# Altium schematic sheet Hat.SchDoc: Group 32 Hat
size A3; DrawnBy: *Names to Left*; Address1: ECE Department; Address2: University of Canterbury; Address3: Christchurch 8041; Address4: New Zealand; Revision: 1; ImagePath: C:\Users\fletc\Documents\Uni Notes\Third Pro\ENCE461\PCB\wacky-racers-pcb\Templates\uc-logo.png
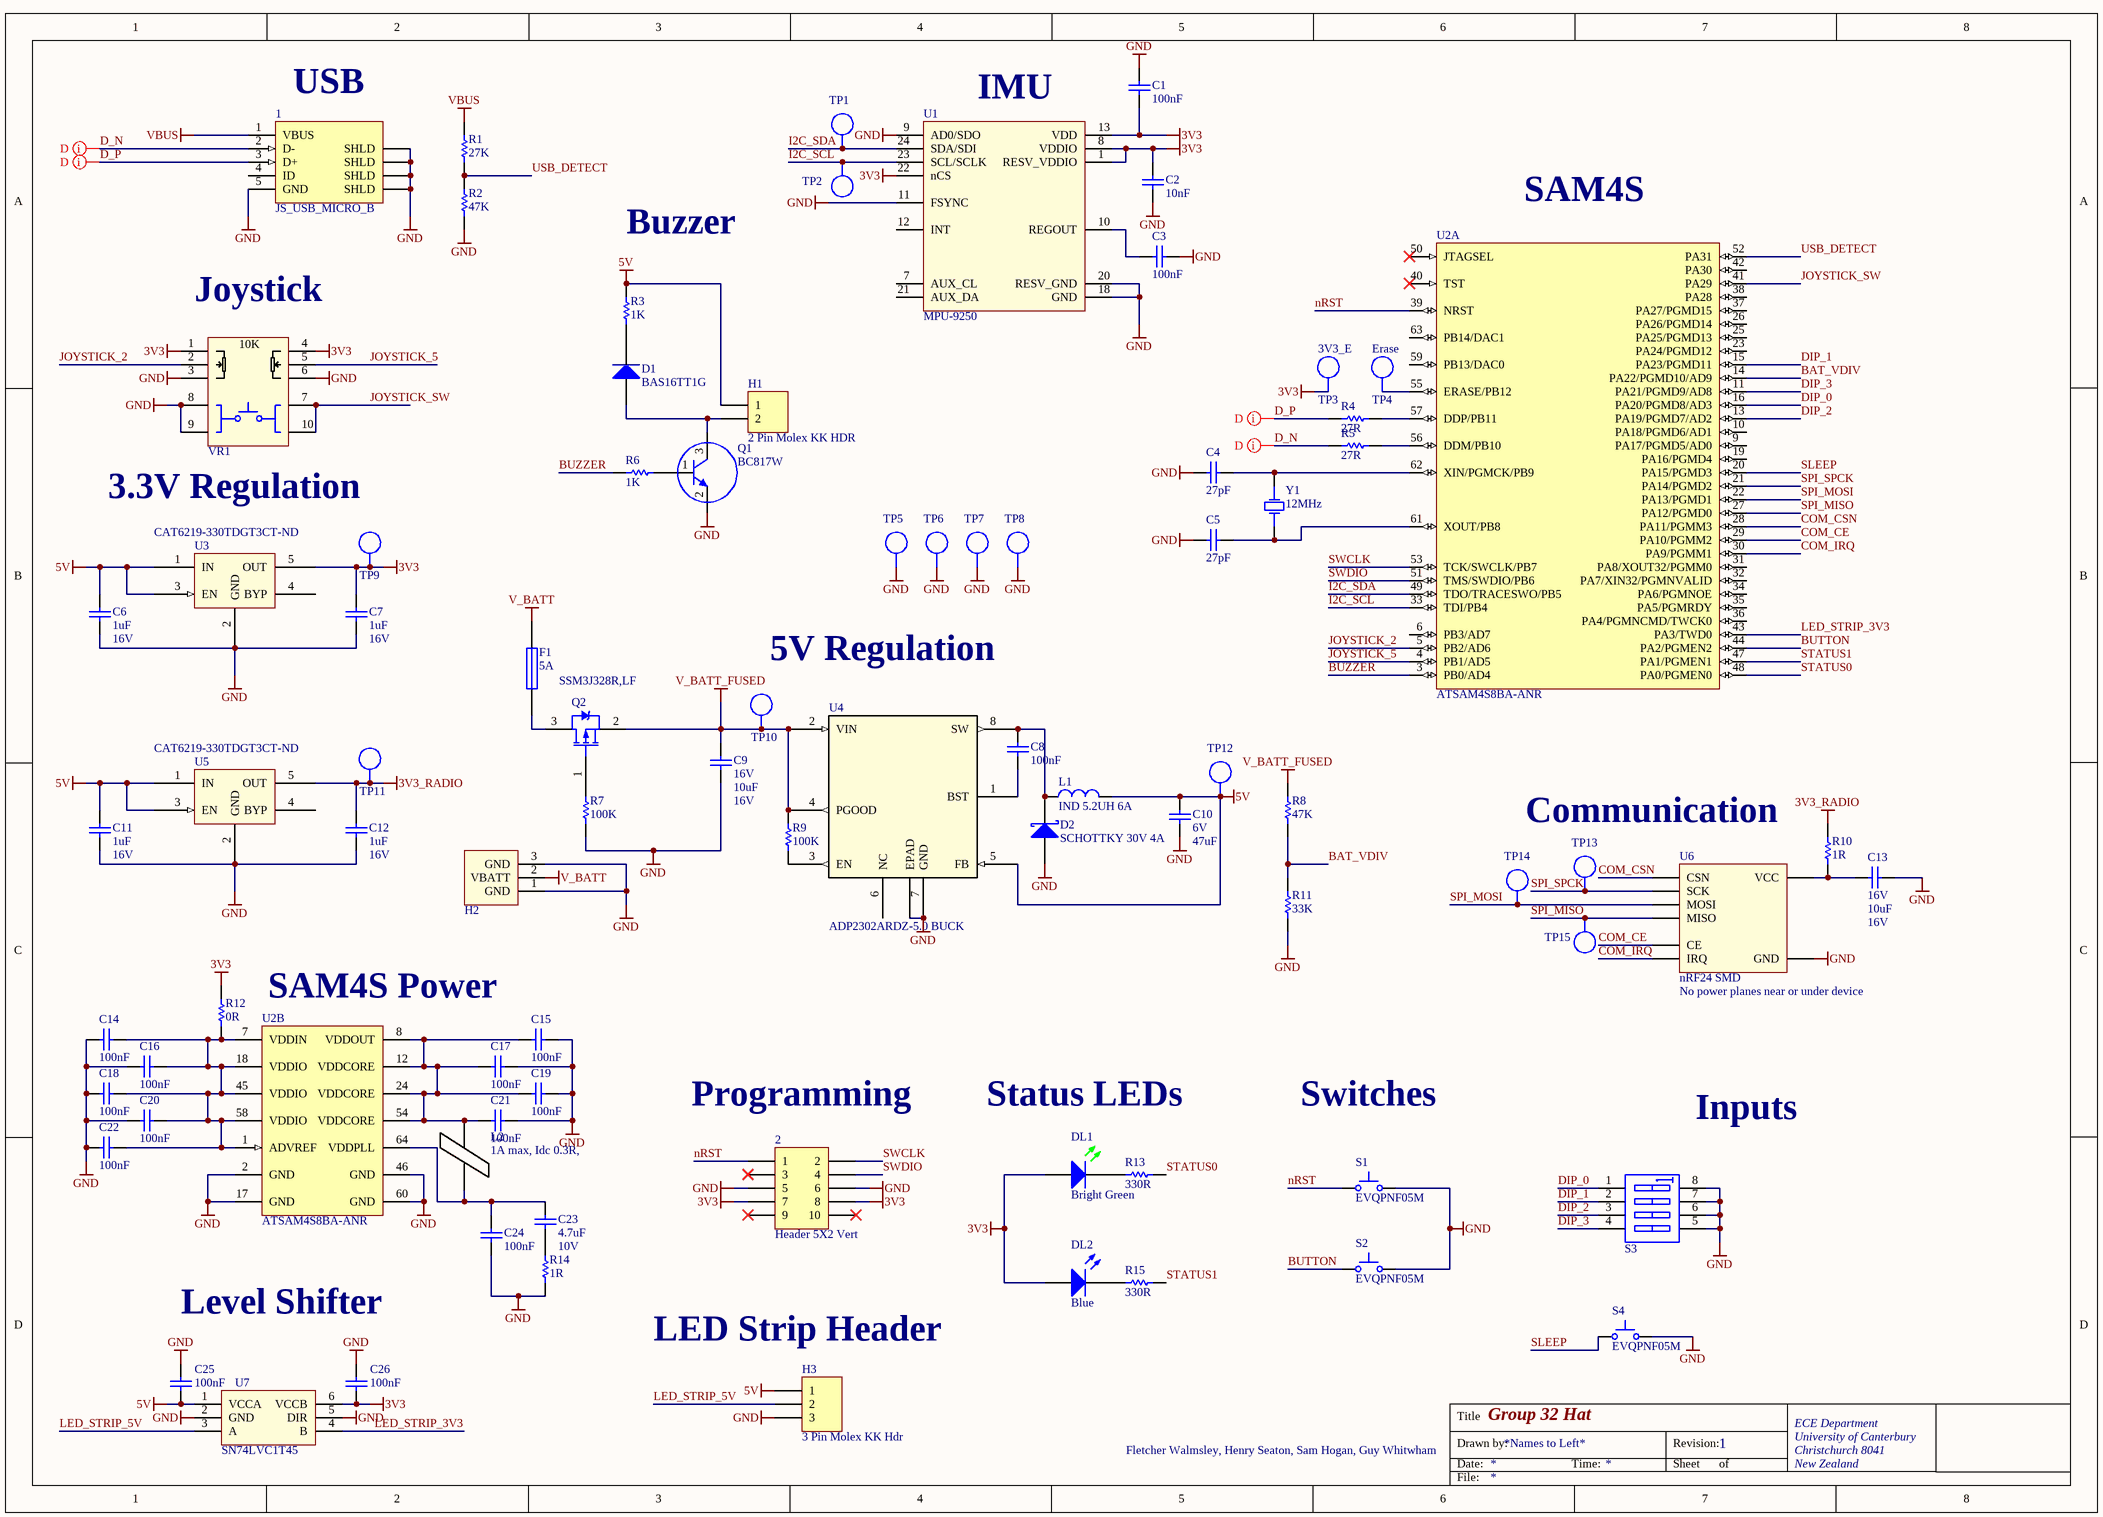
[diagram p0: Hat.SchDoc]

## Parts
1  JS_USB_MICRO_B  [FCI_USB_10118194-0001LF]
2  Header 5X2 Vert  [IDC2.54-V10D]
C1  100nF  [CAPC1608L]
C2  10nF  [CAPC1608L]
C3  100nF  [CAPC1608L]
C4  27pF  [CAPC1608L]
C5  27pF  [CAPC1608L]
C6  Max Voltage: 16V  [CAPC1608L]  (hidden comment: 1uF)
C7  Max Voltage: 16V  [CAPC1608L]  (hidden comment: 1uF)
C8  100nF  [CAPC1608L]
C9  Voltage - Rated: 16V  [CAPC2012L]  (hidden comment: 10uF)
C10  Max Voltage: 6V  [CAPC3216L]  (hidden comment: 47uF)
C11  Max Voltage: 16V  [CAPC1608L]  (hidden comment: 1uF)
C12  Max Voltage: 16V  [CAPC1608L]  (hidden comment: 1uF)
C13  Voltage - Rated: 16V  [CAPC2012L]  (hidden comment: 10uF)
C14  100nF  [CAPC1608L]
C15  100nF  [CAPC1608L]
C16  100nF  [CAPC1608L]
C17  100nF  [CAPC1608L]
C18  100nF  [CAPC1608L]
C19  100nF  [CAPC1608L]
C20  100nF  [CAPC1608L]
C21  100nF  [CAPC1608L]
C22  100nF  [CAPC1608L]
C23  Max Voltage: 10V  [CAPC1608N]  (hidden comment: 4.7uF)
C24  100nF  [CAPC1608L]
C25  100nF  [CAPC1608L]
C26  100nF  [CAPC1608L]
D1  BAS16TT1G  [SOT416]
D2  SCHOTTKY 30V 4A  [SMC]
DL1  Bright Green  [WL-SMCW0603]
DL2  Blue  [WL-SMCW0603]
F1  5A  [RESC3216N]
H1  2 Pin Molex KK HDR  [MOLEX_KK_2_HDR]
H2  Battery_HEADER_3pin  [BATT_HEADER_3POS]  (value not drawn)
H3  3 Pin Molex KK Hdr  [MOLEX_KK_3_HDR]
L1  IND 5.2UH 6A  [INDUCTOR5u2]
L2  1A max, Idc 0.3R,  [INDC3216L]
Q1  BC817W  [SOT323_M]
Q2  SSM3J328R,LF  [SOT23_L]
R1  27K  [RESC1608L]
R2  47K  [RESC1608N]
R3  1K  [RESC1608L]
R4  27R  [RESC1608L]
R5  27R  [RESC1608L]
R6  1K  [RESC1608L]
R7  100K  [RESC1608L]
R8  47K  [RESC1608N]
R9  100K  [RESC1608L]
R10  1R  [RESC3216L]
R11  33K  [RESC1608L]
R12  0R  [RESC1608L]
R13  330R  [RESC1608L]
R14  1R  [RESC3216L]
R15  330R  [RESC1608L]
S1  EVQPNF05M  [EVQPNF05M]
S2  EVQPNF05M  [EVQPNF05M]
S3  WS_SW DIP-4  [DIP_SW_4WAY_SMD -]  (value not drawn)
S4  EVQPNF05M  [EVQPNF05M]
TP1  SDA  [TP_1206]  (value not drawn)  (no BOM)
TP2  SCK  [TP_1206]  (value not drawn)  (no BOM)
TP3  3V3_E  [TP_1206]  (no BOM)
TP4  Erase  [TP_1206]  (no BOM)
TP5  GND  [TP_1206]  (value not drawn)  (no BOM)
TP6  GND  [TP_1206]  (value not drawn)  (no BOM)
TP7  GND  [TP_1206]  (value not drawn)  (no BOM)
TP8  GND  [TP_1206]  (value not drawn)  (no BOM)
TP9  3V3  [TP_1206]  (value not drawn)  (no BOM)
TP10  V_BATT  [TP_1206]  (value not drawn)  (no BOM)
TP11  3V3_R  [TP_1206]  (value not drawn)  (no BOM)
TP12  5V  [TP_1206]  (value not drawn)  (no BOM)
TP13  SPCK  [TP_1206]  (value not drawn)  (no BOM)
TP14  MOSI  [TP_1206]  (value not drawn)  (no BOM)
TP15  MISO  [TP_1206]  (value not drawn)  (no BOM)
U1  MPU-9250  [Quad24]
U2  ATSAM4S8BA-ANR  [LQFP64_L]  (parts A,B of 2)
U3  Supplier Part Number: CAT6219-330TDGT3CT-ND  [SOT95P280X145-5N]  (hidden comment: CAT6219-330TDGT3)
U4  ADP2302ARDZ-5.0 BUCK  [RD_8_1]
U5  Supplier Part Number: CAT6219-330TDGT3CT-ND  [SOT95P280X145-5N]  (hidden comment: CAT6219-330TDGT3)
U6  nRF24 SMD  Warning: No power planes near or under device  [NRF24]
U7  SN74LVC1T45  [SOT23-6_N]
VR1  Joystick 10k with Sw  [Joystick_Sw]  (value not drawn)
Y1  12MHz  [6.0X3.5-4]

## Nets
3V3: 2.7 2.8 C1.1 C2.2 C7.2 C26.1 DL1.2(A) DL2.2(A) R12.2 TP3.1 TP9.1 U1.1(RESV_VDDIO) U1.8(VDDIO) U1.13(VDD) U1.22(nCS) U3.5(OUT) U7.6(VCCB) VR1.1 VR1.4(1')
3V3_RADIO: C12.2 R10.2 TP11.1 U5.5(OUT)
5V: C6.2 C10.2 C11.2 C25.1 H1.1 H3.1 L1.2 R3.1 TP12.1 U3.1(IN) U3.3(EN) U4.5(FB) U5.1(IN) U5.3(EN) U7.1(VCCA)
GND: 1.5(GND) 1.6(SHLD) 2.5 2.6 C1.2 C2.1 C3.2 C4.1 C5.1 C6.1 C7.1 C9.1 C10.1 C11.1 C12.1 C13.1 C14.1 C15.2 C16.1 C17.2 C18.1 C19.2 C20.1 C21.2 C22.1 C24.1 C25.2 C26.2 D2.1(A) H2.1(GND) H2.3(GND) H3.3 Q1.2 R2.1 R7.1 R11.2 R14.2 S1.2 S2.2 S3.5(B4) S3.6(B3) S3.7(B2) S3.8(B1) S4.2 TP5.1 TP6.1 TP7.1 TP8.1 U1.9(AD0/SDO) U1.11(FSYNC) U1.18(GND) U1.20(RESV_GND) U2.2(GND) U2.17(GND) U2.46(GND) U2.60(GND) U3.2(GND) U4.7(GND) U4.EPAD U5.2(GND) U6.2(GND) U7.2(GND) U7.5(DIR) VR1.3 VR1.6(3') VR1.8 VR1.9
V_BATT: F1.2 H2.2(VBATT)
V_BATT_FUSED: C9.2 Q2.2 R8.1 R9.2 TP10.1 U4.2(VIN) U4.4(PGOOD)
VBUS: 1.1(VBUS) R1.2
BAT_VDIV: R8.2 R11.1 U2.14(PA22/PGMD10/AD9)
BUTTON: S2.1 U2.44(PA2/PGMEN2)
BUZZER: R6.2 U2.3(PB0/AD4)
COM_CE: U2.29(PA10/PGMM2) U6.3(CE)
COM_CSN: U2.28(PA11/PGMM3) U6.4(CSN)
COM_IRQ: U2.30(PA9/PGMM1) U6.8(IRQ)
D_N: 1.2(D-) R5.1
D_P: 1.3(D+) R4.1
DIP_0: S3.1(A1) U2.16(PA20/PGMD8/AD3)
DIP_1: S3.2(A2) U2.15(PA23/PGMD11)
DIP_2: S3.3(A3) U2.13(PA19/PGMD7/AD2)
DIP_3: S3.4(A4) U2.11(PA21/PGMD9/AD8)
I2C_SCL: TP2.1 U1.23(SCL/SCLK) U2.33(TDI/PB4)
I2C_SDA: TP1.1 U1.24(SDA/SDI) U2.49(TDO/TRACESWO/PB5)
JOYSTICK_2: U2.5(PB2/AD6) VR1.2
JOYSTICK_5: U2.4(PB1/AD5) VR1.5(2')
JOYSTICK_SW: U2.41(PA29) VR1.7 VR1.10
LED_STRIP_3V3: U2.43(PA3/TWD0) U7.4(B)
LED_STRIP_5V: H3.2 U7.3(A)
nRST: 2.1 S1.1 U2.39(NRST)
SLEEP: S4.1 U2.20(PA15/PGMD3)
SPI_MISO: TP15.1 U2.27(PA12/PGMD0) U6.7(MISO)
SPI_MOSI: TP14.1 U2.22(PA13/PGMD1) U6.6(MOSI)
SPI_SPCK: TP13.1 U2.21(PA14/PGMD2) U6.5(SCK)
STATUS0: R13.2 U2.48(PA0/PGMEN0)
STATUS1: R15.2 U2.47(PA1/PGMEN1)
SWCLK: 2.2 U2.53(TCK/SWCLK/PB7)
SWDIO: 2.4 U2.51(TMS/SWDIO/PB6)
USB_DETECT: R1.1 R2.2 U2.52(PA31)
NetC3_1: C3.1 U1.10(REGOUT)
NetC4_2: C4.2 U2.62(XIN/PGMCK/PB9) Y1.3(OSC2)
NetC5_2: C5.2 U2.61(XOUT/PB8) Y1.1(OSC1)
NetC8_1: C8.1 U4.1(BST)
NetC8_2: C8.2 D2.2(K) L1.1 U4.8(SW)
NetC13_2: C13.2 R10.1 U6.1(VCC)
NetC14_2: C14.2 C16.2 C18.2 C20.2 C22.2 R12.1 U2.1(ADVREF) U2.7(VDDIN) U2.18(VDDIO) U2.45(VDDIO) U2.58(VDDIO)
NetC15_1: C15.1 C17.1 C19.1 C21.1 L2.2 U2.8(VDDOUT) U2.12(VDDCORE) U2.24(VDDCORE) U2.54(VDDCORE)
NetC23_1: C23.1 C24.2 L2.1 U2.64(VDDPLL)
NetC23_2: C23.2 R14.1
NetD1_1: D1.1(A) H1.2 Q1.3
NetD1_3: D1.3(K) R3.2
NetDL1_1: DL1.1(K) R13.1
NetDL2_1: DL2.1(K) R15.1
NetF1_1: F1.1 Q2.3
NetQ1_1: Q1.1 R6.1
NetQ2_1: Q2.1 R7.2
NetR4_2: R4.2 U2.57(DDP/PB11)
NetR5_2: R5.2 U2.56(DDM/PB10)
NetR9_1: R9.1 U4.3(EN)
NetTP4_1: TP4.1 U2.55(ERASE/PB12)

Not connected (* = marked no-connect by the designer): 1 4(ID); 2 3* 9* 10*; U1 7(AUX_CL) 12(INT) 21(AUX_DA); U2 6(PB3/AD7) 9(PA17/PGMD5/AD0) 10(PA18/PGMD6/AD1) 19(PA16/PGMD4) 23(PA24/PGMD12) 25(PA25/PGMD13) 26(PA26/PGMD14) 31(PA8/XOUT32/PGMM0) 32(PA7/XIN32/PGMNVALID) 34(PA6/PGMNOE) 35(PA5/PGMRDY) 36(PA4/PGMNCMD/TWCK0) 37(PA27/PGMD15) 38(PA28) 40(TST)* 42(PA30) 50(JTAGSEL)* 59(PB13/DAC0) 63(PB14/DAC1); U3 4(BYP); U4 6(NC); U5 4(BYP)

## Layout directives
differential pair: D_N, D_P

## Notes on the sheet
- (near 1) USB
- (near U1) IMU
- (near U2) SAM4S
- Buzzer
- (near VR1) Joystick
- 3.3V Regulation
- 5V Regulation
- Communication
- (near U2) SAM4S Power
- (near 2) Programming
- Status LEDs
- Switches
- Inputs
- Level Shifter
- (near H3) LED Strip Header
- Fletcher Walmsley, Henry Seaton, Sam Hogan, Guy Whitwham
- Title
- Drawn by:
- Date:
- Time:
- Revision:
- Sheet
- of
- File:
- (in symbol Joystick 10k with Sw) 10K

## Library data of the parts
1 = JS_USB_MICRO_B_SMT: CONN USB MICRO B RECPT SMT R/A; Manufacturer: FCI; Manufacturer Part Number: 10118194-0001LF; Gender: Receptacle; Number of Contacts: 5; Specifications: USB 2.0; Supplier 1: Digi-Key; Supplier Part Number 1: 609-4618-1-ND; Features: Shielded, Solder Retention; Mounting Type: Surface Mount, Right Angle, Horizontal
2 = JA_HDR_IDC_5X2_VERT: IDC Header, 2,54mm, 10-Pin, Vert; Supplier: ECE Dept; Supplier 1: Farnell; Supplier Part Number 1: 1096985; Storage Location: ECE Dept Store
C1 C3 C8 C14-C22 C24-C26 = CC_100nF_0603: CAP CER 100nF X7R +-10% 50V 0603; PackageReference: 0603; Code_IPC: 1608 [0603]; Verify: *; Supplier: ECE Dept; Storage Location: PCB Assembly WS; Value: 100nF
C2 = CC_10nF_0603: CAP CER 10nF X7R +-10% 50V 0603; PackageReference: 0603; Code_IPC: 1608 [0603]; Verify: *; Supplier: ECE Dept; Storage Location: PCB Assembly WS; Value: 10nF
C4 C5 = CC_27pF_0603: CAP CER 27pF NPO/COG +-5% 50V 0603; PackageReference: 0603; Code_IPC: 1608 [0603]; Verify: *; Supplier: ECE Dept; Storage Location: PCB Assembly WS; Value: 27pF
C6 C7 C11 C12 = CC_1uF_0603: CAP CER 1uF Y5V -20% +80% 16V 0603; PackageReference: 0603; Code_IPC: 1608 [0603]; Verify: *; Supplier: ECE Dept; Storage Location: PCB Assembly WS; Value: 1uF
C9 C13 = CC_10uF_16V_0805: CAP CER 10uF X5R 16V 0805; Manufacturer: Samsung Electro-Mechanics; Manufacturer Part Number: CL21A106KOQNNWE; Note: Footprint corresponds to dimensions for bulk cassette packaging. This case size has tightened tolerances.; Tolerance: ±10%; Notification: Current market demand for these product types have resulted in fluctuating and extending lead times. Lead times may differ.; PackageReference: 0805; Code_IPC: 2012[0805]; Supplier 1: Digi-Key; RoHS: RoHS Compliant; Category: Capacitors; Stock 1: 20000; Pricing 1: 1=0.35, 10=0.25, 100=0.1178, 500=0.08254, 1000=0.06831 (NZD); Packaging: Cut Tape (CT); Part Status: Active; Temperature Coefficient: X5R; Operating Temperature: -55°C ~ 85°C; Features: -; Ratings: -; Applications: General Purpose; Mounting Type: Surface Mount, MLCC; Package / Case: 0805 (2012 Metric); Size / Dimension: 0.079" L x 0.049" W (2.00mm x 1.25mm); Height - Seated (Max): -; Thickness (Max): 0.055" (1.40mm); Lead Spacing: -; Lead Style: -; ComponentLink1URL: http://www.samsungsem.com/kr/support/product-search/mlcc/CL21A106KOQNNWE.jsp; ComponentLink1Description: http://www.samsungsem.com/kr/support/product-search/mlcc/CL21A106KOQNNWE.jsp; Supplier Part Number 1: 1276-2894-1-ND; Value: 10uF; Max Voltage: 16V
C10 = CC_47uF_1206: CAP CER 47uF X5R -/+20% 6V 1206; Verify: *; Supplier: ECE Dept; Storage Location: PCB Assembly WS; Dielectric: X5R; Footprint: 1210 (3225 metric); MoV: 6V; Value: 47uF
C23 = CC_4.7uF_0603: CAP CER 4.7uF X5R +-20%  10V 0603; Note: Footprint corresponds to dimensions for bulk cassette packaging. This case size has tightened tolerances.; PackageReference: 0805; Code_IPC: 2012[0805]; Verify: *; Supplier: ECE Dept; Storage Location: PCB Assembly WS; Value: 4.7uF
D1 = DR_BAS16TT1G: Diode Switching, Vr 75V, 200mA, SOT-416; Manufacturer: ON Semiconductor; Max Surge Current: 500mA; Forward Voltage: 1.25V; Peak Reverse Current: 1uA; Recovery Time: 6ns; Power Dissipation: 225mW; Element Configuration: Single; Polarity: Standard; Max Reverse Voltage (DC): 100V; Manufacturer PN: BAS16TT1G; Storage Location: PCB Assembly WS; Supplier: ECE Dept; Manufacturer Part Number: BAS16TT1G; Case/Package: SOT-416-3; Number of Pins: 3; Contact Plating: Tin,Matte; Min Operating Temperature: -55°C; Max Operating Temperature: 150°C; Package Quantity: 1; Packaging: Tape and Reel; Forward Current: 200mA; Average Rectified Current: 200mA; Reverse Recovery Time: 6ns; Peak Non-Repetitive Surge Current: 500mA; Max Repetitive Reverse Voltage (Vrrm): 75V; Max Forward Surge Current (Ifsm): 500mA; Current Rating: 200mA; Output Current: 200mA; Length: 1.65mm; Height: 0.9mm; Width: 0.9mm; Radiation Hardening: No; REACH SVHC: No SVHC; Lead Free: Lead Free; Halogen Free: Halogen Free; ComponentLink1URL: https://datasheet.ciiva.com/8299/bas16tt1-d-8299729.pdf; ComponentLink1Description: https://datasheet.ciiva.com/8299/bas16tt1-d-8299729.pdf; ComponentLink2URL: https://datasheet.ciiva.com/4435/bas16tt1-d-103455-4435027.pdf; ComponentLink2Description: https://datasheet.ciiva.com/4435/bas16tt1-d-103455-4435027.pdf; ComponentLink3URL: https://datasheet.ciiva.com/28646/bas16tt1-d-28646580.pdf; ComponentLink3Description: https://datasheet.ciiva.com/28646/bas16tt1-d-28646580.pdf; ComponentLink4URL: https://datasheet.ciiva.com/16393/bas16tt1-d-16393622.pdf; ComponentLink4Description: https://datasheet.ciiva.com/16393/bas16tt1-d-16393622.pdf; ComponentLink5URL: https://datasheet.ciiva.com/923/bas16tt1-d-923016.pdf; ComponentLink5Description: https://datasheet.ciiva.com/923/bas16tt1-d-923016.pdf; ComponentLink6URL: https://datasheet.ciiva.com/923/bas16tt1-d-923017.pdf; ComponentLink6Description: https://datasheet.ciiva.com/923/bas16tt1-d-923017.pdf; ComponentLink7URL: https://datasheet.ciiva.com/923/bas16tt1-d-923018.pdf; ComponentLink7Description: https://datasheet.ciiva.com/923/bas16tt1-d-923018.pdf; ComponentLink8URL: https://datasheet.ciiva.com/25930/bas16tt1-d-25930986.pdf; ComponentLink8Description: https://datasheet.ciiva.com/25930/bas16tt1-d-25930986.pdf; Supplier 1: Digi-Key; Supplier 2: Farnell; Supplier Part Number 2: 2844752; Supplier Part Number 1: BAS16TT1GOSDKR-ND; Value: BAS16TT1G
D2 = MBRS330T3G: DIODE SCHOTTKY 30V 4A SMC; Manufacturer: ON Semiconductor; Speed: Fast Recovery =< 500ns, > 200mA (Io); Supplier 1: Digi-Key; Manufacturer Part Number: MBRS330T3G; RoHS: RoHS Compliant; Category: Discrete Semiconductor Products; Stock 1: 8919; Pricing 1: 1=0.93, 10=0.79, 100=0.5902, 500=0.46368, 1000=0.35829 (NZD); Packaging: Cut Tape (CT); Part Status: Active; Diode Type: Schottky; Current - Average Rectified (Io): 4A; Capacitance @ Vr, F: -; Mounting Type: Surface Mount; Package / Case: DO-214AB, SMC; Supplier Device Package: SMC; Operating Temperature - Junction: -65°C ~ 150°C; Base Part Number: MBRS330; ComponentLink1URL: http://www.onsemi.com/pub/Collateral/MBRS340T3-D.PDF; ComponentLink1Description: http://www.onsemi.com/pub/Collateral/MBRS340T3-D.PDF; Supplier Part Number 1: MBRS330T3GOSCT-ND
DL1 = DL_150060VS75000: LED Bright Green 40mcd 0603 SMD; Manufacturer: WURTH ELEKTRONIK; Forward Current If: 30; Forward Voltage: 2; Viewing Angle: 140°; Wavelength Typ: 570; Luminous Intensity: 40; LED Mounting: SMD; Supplier 1: Farnell; Supplier Part Number 1: 2322073; Manufacturer Part Number: 150060VS75000; Storage Location: PCB Assembly WS; Supplier: ECE Dept; LED Colour: Bright Green
DL2 = DL_150060BS75000: LED Blue 270mcd 0603 SMD; Manufacturer: WURTH ELEKTRONIK; Forward Current If: 30; Forward Voltage: 3.2; Luminous Intensity: 270; Viewing Angle: 120°; Wavelength Typ: 470; Pricing: 1=0.3844, 50=0.3252, 100=0.2957, 500=0.2365 (NZD); Supplier 1: Farnell; Supplier Part Number 1: 2322069; Manufacturer Part Number: 150060BS75000; Storage Location: PCB Assembly WS; Supplier: ECE Dept; LED Colour: Blue
F1 = FS_Fuse_5.0A: Fuse 5.0A Fast Acting 1206 SMD; Manufacturer Part Number: C1F5; Manufacturer: Bel TRP; Voltage Rating (AC): 125V; Voltage Rating (DC): 63V; DC Cold Resistance: 19mR; Fuse Type: Board Mount (Cartridge Style Excluded); Approvals: CE,cURus; Mount: Surface Mount; Case/Package: 1206; Number of Pins: 2; Case Code (Metric): 3216; Case Code (Imperial): 1206; Contact Plating: Nickel,Tin; Min Operating Temperature: -55°C; Max Operating Temperature: 125°C; Packaging: Tape and Reel; Voltage Rating: 125V; Length: 0.126inch; Width: 0.062inch; Supplier 1: Digi-Key; Stock 1: 725; Pricing 1: 1=0.32, 5=0.312, 10=0.298, 50=0.2662, 100=0.2479, 250=0.22032, 500=0.1836, 1000=0.17442 (USD); ComponentLink1URL: http://www.farnell.com/datasheets/2571625.pdf; ComponentLink1Description: http://www.farnell.com/datasheets/2571625.pdf; ComponentLink2URL: http://belfuse.com/pdfs/C1F.pdf; ComponentLink2Description: http://belfuse.com/pdfs/C1F.pdf; ComponentLink3URL: http://www.mouser.com/ds/2/643/C1F-594910.pdf; ComponentLink3Description: http://www.mouser.com/ds/2/643/C1F-594910.pdf; ComponentLink4URL: https://belfuse.com/resources/StewartConnector/C1F.pdf; ComponentLink4Description: https://belfuse.com/resources/StewartConnector/C1F.pdf; Current Rating: 5A; Supplier Part Number 1: 507-1886-1-ND; Supplier 2: Element14; Supplier Part Number 2: 2848595; Value: 5A
H1 = JA_MOLEX_KK_2POS: CONN HEADER 2POS 2.54mm VERT_Thru Hole; Supplier 1: Farnell; Supplier Part Number 1: 1462926; Supplier: ECE Dept; Storage Location: ECE Dept Store; Value: 2 Pin Molex KK HDR
H2 = Battery_HEADER_3pin: 3Pin Header 2.54mm spacing
H3 = JA_MOLEX_KK_3POS: CONN HEADER 3POS 2.54mm VERT_Thru Hole; Manufacturer: Molex; Manufacturer PN: 22-23-2031; Supplier Part Number 1: 9731156; Supplier: ECE Dept; Supplier 1: Farnell; Storage Location: ECE Dept Store; Value: 3 Pin Molex KK Hdr
L1 = CDRH104RNP-5R2NC: FIXED IND 5.2UH 6A 22 MOHM SMD; Manufacturer: Sumida America Components Inc.; Material - Core: Ferrite; Tolerance: ±30%; Current - Saturation: 5.6A; Shielding: Shielded; DC Resistance (DCR): 22 mOhm Max; Supplier 1: Digi-Key; Manufacturer Part Number: CDRH104RNP-5R2NC; RoHS: RoHS Compliant; Category: Inductors, Coils, Chokes; Stock 1: 3849; Pricing 1: 1=2.9, 10=2.678, 100=1.8743, 500=1.5173 (NZD); Packaging: Cut Tape (CT); Part Status: Active; Type: -; Q @ Freq: -; Frequency - Self Resonant: -; Ratings: -; Operating Temperature: -40°C ~ 100°C; Mounting Type: Surface Mount; Package / Case: Nonstandard; Supplier Device Package: -; Size / Dimension: 0.402" L x 0.394" W (10.20mm x 10.00mm); Height - Seated (Max): 0.157" (4.00mm); ComponentLink1URL: http://products.sumida.com/products/pdf/CDRH104R.pdf; ComponentLink1Description: http://products.sumida.com/products/pdf/CDRH104R.pdf; Supplier Part Number 1: 308-2280-1-ND
L2 = IN_Ferrite-Bead: Ferrite Bead, Rdc 0.3R, Z100MHZ 600R, Imax 1A, SMD 1206; Manufacturer: FAIR-RITE; Manufacturer PN: 2512066017Y1; DC Current Rating: 1; DC Resistance Max: 0.08; Ferrite Case Style: 1206 ^3216 Metric]; Frequency Range: 50MHz to 1; Impedance: 600; Impedance Tolerance: ± 25%; Supplier: ECE Dept; Storage Location: PCB Assembly WS; Ferrite Mounting: SMD; Supplier 1: Farnell; Supplier Part Number 1: 1612060; Manufacturer Part Number: 2512066017Y1; Value: 1A max, Idc 0.3R,
Q1 = TB_BC817W: NPN GP Bipolar Transistor 45V 500mA SOT323; Manufacturer: NXP; Supplier 1: Farnell; Supplier Part Number 1: 2114873; Manufacturer PN: BC817W; Storage Location: PCB Assembly WS; Supplier: ECE Dept; Value: BC817W
Q2 = TM_SSM3J328R: MOSFET P-CH 20V 6A SOT23-3; Manufacturer: Toshiba; FET Feature: Logic Level Gate, 1.5V Drive; FET Type: MOSFET P-Channel, Metal Oxide; Gate Charge (Qg) @ Vgs: 12.8nC @ 4.5V; Input Capacitance (Ciss) @ Vds: 840pF @ 10V; Power - Max: 1W; Rds On Max: 29.8mR; Drain to Source Resistance: 47.4mR; Turn-On Delay Time: 32ns; Power Dissipation: 2W; Number of Channels: 1; Turn-Off Delay Time: 107ns; Gate to Source Voltage (Vgs): 8V; Input Capacitance: 840pF; Element Configuration: Single; Drain to Source Breakdown Voltage: -20V; Vgs(th) (Max) @ Id: 1V @ 1mA; Current - Continuous Drain (Id) @ 25° C: 6A; Drain to Source Voltage (Vdss): 20V; Package / Case: SOT-23-3 Flat Leads; Supplier Device Package: SOT-23F; Pricing: 1=0.79, 10=0.658, 25=0.5772, 100=0.4939, 250=0.42836, 500=0.36284, 1000=0.27972 (NZD); Storage Location: PCB Assembly WS; Supplier: Digi-Key; ComponentLink1URL: https://datasheet.ciiva.com/11158/ssm3j328r-datasheet-en-20140301-11158652.pdf; ComponentLink1Description: https://datasheet.ciiva.com/11158/ssm3j328r-datasheet-en-20140301-11158652.pdf; Supplier Part Number: SSM3J328RLFDKR-ND; Max Operating Temperature: 150°C; Mount: Surface Mount; Packaging: Tape and Reel; Min Operating Temperature: -55°C; Continuous Drain Current (ID): 6A; Radiation Hardening: No; Max Power Dissipation: 1W; Package Quantity: 3000; Case/Package: SOT-23-3; Number of Pins: 3; Number of Elements: 1; Supplier 1: Digi-Key; Supplier Part Number 1: SSM3J328RLFDKR-ND; Manufacturer Part Number: SSM3J328R,LF
R1 = RS_27K: RES 27K OHM 1/10W 5% 0603 SMD; Storage Location: PCB Assembly WS; Supplier: ECE Dept; Value: 27K
R2 R8 = RS_47K: RES 47.0K OHM 1/10W 5% 0603 SMD; Storage Location: PCB Assembly WS; Supplier: ECE Dept; Value: 47K
R3 R6 = RS_1K: RES 1.0K OHM 1/10W 5% 0603 SMD; Storage Location: PCB Assembly WS; Supplier: ECE Dept; Value: 1K
R4 R5 = RS_27R: RES 27 OHM 1/10W 5% 0603 SMD; Storage Location: PCB Assembly WS; Supplier: ECE Dept; Value: 27R
R7 R9 = RS_100K: RES 100K OHM 1/10W 5% 0603 SMD; Storage Location: PCB Assembly WS; Supplier: ECE Dept; Value: 100K
R10 R14 = RT_1R: RES 1R OHM 1/4W 5% 1206 SMD; Storage Location: PCB Assembly WS; Supplier: ECE Dept; Value: 1R
R11 = RS_33K: RES 33.0K OHM 1/10W 5% 0603 SMD; Storage Location: PCB Assembly WS; Supplier: ECE Dept; Value: 33K
R12 = RS_0R0: RES 0.0 OHM 1/10W 5% 0603 SMD; Storage Location: PCB Assembly WS; Supplier: ECE Dept; Value: 0R
R13 R15 = RS_330R: RES 330 OHM 1/10W 5% 0603 SMD; Storage Location: PCB Assembly WS; Supplier: ECE Dept; Value: 330R
S1 S2 S4 = WS_EVQPNF05M: Panasonic 6 x 3.5mm SMD Light Touch Switch Type SMD; PackageDescription: 6.0 x 3.5 mm; Supplier 1: Farnell; Supplier Part Number 1: 2079481; Manufacturer: Panasonic; Manufacturer PN: EVQPNF05M; Supplier 2: Digi-Key; Supplier Part Number 2: P13598SCT-ND; Storage Location: PCB Assembly WS; Supplier: ECE Dept
S3 = WS_SW DIP-4: DIP Switch, 4 Position, SPST SMD; Manufacturer: OMRON ELECTRONIC COMPONENTS; Manufacturer Part Number: A6SN-4101; Contact Current DC Max: 25; External Length / Height: 12.1; No. of Switch Positions: 4; Pitch Spacing: 2.54; Contact Configuration: SPST; Supplier 1: Farnell; Supplier Part Number 1: 2029425; Storage Location: PCB Assembly WS; Supplier: ECE Dept
TP1-TP15 = TP_1206: Test-Point 3.3x1.6x2.1mm SMD; Manufacturer: Harwin Inc; Manufacturer Part Number: S1751-46R; Value: TP; Manufacturer PN: *; Storage Location: ProtoPlace; Mounting Type: Surface Mount; Type: PC Test Point; Supplier 1: Digi-Key; Supplier Part Number 1: 952-1478-2-ND; Supplier 2: Farnell; Supplier Part Number 2: 1826282; Supplier: ECE Dept
U1 = MPU-9250: 9 axis IMU
U2 = SE_ATSAM4S16BA-MU: IC MCU 32BIT 512KB FLASH 64LQFP; Manufacturer: Atmel; Connectivity: I²C, IrDA, Memory Card, SPI, SSC, UART/USART, USB; Core Processor: ARM® Cortex®-M4; Core Size: 32-Bit; Data Converters: A/D 11x12b, D/A 2x12b; Number of I/O: 47; Peripherals: Brown-out Detect/Reset, DMA, POR, PWM, WDT; Program Memory Size: 512KB (512K x 8); RAM Size: 128K x 8; Speed: 120MHz; Voltage - Supply (Vcc/Vdd): 1.62 V ~ 3.6 V; PackageVersion: revJ, Jul-2007; PackageReference: 64PS; PackageDescription: 64-Pin Quad Flat No-Lead (QFN) Sawn, 9 x 9 x 1.0 mm Body, 0.5 mm Pitch, Exposed Pad; Code_JEDEC: MO-220VMMD-3; ComponentLink1Description: Manufacturer URL; ComponentLink1URL: http://www.atmel.com/; ComponentLink2Description: SAM4S Series Datasheet; ComponentLink2URL: http://www.atmel.com/dyn/resources/prod_documents/11100.pdf; ComponentLink3Description: SAM4S Series Summary; ComponentLink3URL: http://www.atmel.com/dyn/resources/prod_documents/11100S.pdf; Supplier 1: Digi-Key; Package / Case: 64-LQFP; Packaging: Cut Tape (CT); Program Memory Type: FLASH; Supplier Part Number 1: ATSAM4S8BA-ANRCT-ND; Manufacturer Part Number: ATSAM4S8BA-ANR
U3 U5 = SV_CAT6219-330TDGT3: IC REG LIN 3.3V 500MA TSOT23-5; Voltage - Input (Max): 5.5V; Voltage Dropout (Max): 0.5V @ 500mA; Manufacturer Part Number: CAT6219-330TDGT3; Base Part Number: CAT6219; Current - Output: 500mA; Package / Case: SOT-23-5 Thin, TSOT-23-5; Supplier: Digi-Key; Supplier Device Package: TSOT-23-5; Voltage - Output (Min/Fixed): 3.3V; ComponentLink1URL: http://www.onsemi.com/pub/Collateral/CAT6219-D.PDF; ComponentLink1Description: http://www.onsemi.com/pub/Collateral/CAT6219-D.PDF; Supplier 1: Digi-Key
U4 = ADP2302ARDZ-5.0-R7: IC REG BUCK 5V 2A 8SOIC; Vendor: Analog Devices Inc; Frequency - Switching: 700kHz; Output Type: Fixed; Voltage - Input (Max): 20V; Manufacturer_Part_Number: ADP2302ARDZ-5.0-R7; Type: DEV; Value: Value; Supplier 1: Digi-Key; Current - Output: 2A; Voltage - Output (Min/Fixed): 5V; Supplier Part Number 1: ADP2302ARDZ-5.0-R7CT-ND
U6 = NRF24: nRF24 SMD Module
U7 = SN74LVC1T45: 1.8V - 5V level converter
VR1 = Joystick 10k with Sw: JOYSTICK 10K OHM 2 AXIS TH; Manufacturer 1: SparkFun; Manufacturer Part Number 1: COM-09032; Supplier 1: Digi-Key; Stock 1: 563; Pricing 1: 1=3.95000 (USD); RoHS: No; ComponentLink1URL: https://media.digikey.com/pdf/Data%20Sheets/Sparkfun%20PDFs/COM-09032_Web.pdf?src-supplier=Digi-Key; ComponentLink1Description: https://media.digikey.com/pdf/Data%20Sheets/Sparkfun%20PDFs/COM-09032_Web.pdf?src-supplier=Digi-Key; Supplier Part Number 1: 1568-1526-ND
Y1 = XT_CRYSTAL_12MHz_18pF: CRYSTAL 12MHZ 18PF 6X3.5mm SMD; Manufacturer: CTS-Frequency Controls; Manufacturer Part Number: 406C35D12M00000; ESR (Equivalent Series Resistance): 60 Ohm; Frequency Stability: ±50ppm; Frequency Tolerance: ±30ppm; Operating Mode: Fundamental; Supplier 1: Digi-Key; Height: 0.047" (1.20mm); Load Capacitance: 18pF; Mounting Type: Surface Mount; Operating Temperature: -20°C ~ 70°C; Package / Case: 4-SMD, No Lead (DFN, LCC); Size / Dimension: 0.236" L x 0.138" W (6.00mm x 3.50mm); Supplier Part Number 1: CTX855CT-ND; Frequency: 12MHz